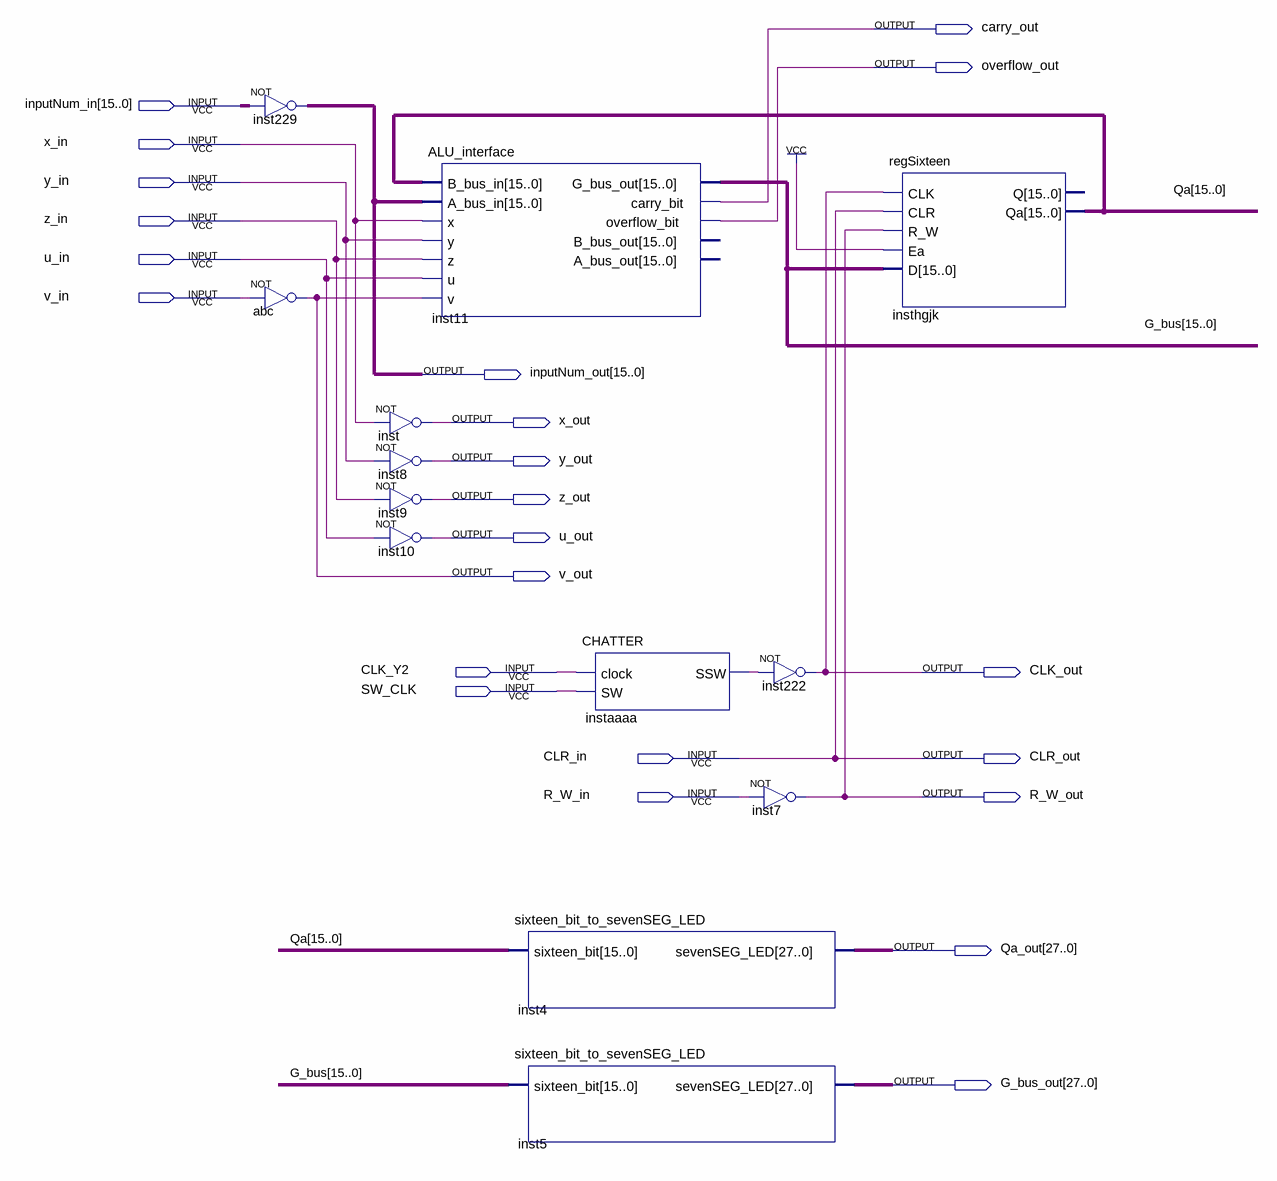
[diagram p0: schematic sheet]
// Quartus schematic ALU_expLogicCircuit.bdf as structural Verilog: 13 symbols, 23 pins
module ALU_expLogicCircuit (
  input  [15:0] inputNum_in,
  input  x_in,
  input  y_in,
  input  z_in,
  input  u_in,
  input  v_in,
  input  CLK_Y2,
  input  SW_CLK,
  input  CLR_in,
  input  R_W_in,
  output carry_out,
  output overflow_out,
  output [15:0] inputNum_out,
  output x_out,
  output y_out,
  output z_out,
  output u_out,
  output v_out,
  output CLK_out,
  output CLR_out,
  output R_W_out,
  output [27:0] Qa_out,
  output [27:0] G_bus_out
);

  wire instaaaa_ssw;
  wire [15:0] G_bus, Qa;

  assign inputNum_out = ~inputNum_in;  // NOT inst229, 16 bits wide
  not abc (v_out, v_in);
  ALU_interface inst11 (
    .B_bus_in(Qa), .A_bus_in(inputNum_out), .x(x_in), .y(y_in), .z(z_in), .u(u_in), .v(v_out),
    .G_bus_out(G_bus), .carry_bit(carry_out), .overflow_bit(overflow_out));  // open: B_bus_out, A_bus_out
  not inst (x_out, x_in);
  not inst8 (y_out, y_in);
  not inst9 (z_out, z_in);
  not inst10 (u_out, u_in);
  sixteen_bit_to_sevenSEG_LED inst4 (.sixteen_bit(Qa), .sevenSEG_LED(Qa_out));
  sixteen_bit_to_sevenSEG_LED inst5 (.sixteen_bit(G_bus), .sevenSEG_LED(G_bus_out));
  CHATTER instaaaa (.clock(CLK_Y2), .SW(SW_CLK), .SSW(instaaaa_ssw));
  not inst222 (CLK_out, instaaaa_ssw);
  not inst7 (R_W_out, R_W_in);
  regSixteen insthgjk (.CLK(CLK_out), .CLR(CLR_in), .R_W(R_W_out), .Ea(1'b1), .D(G_bus), .Qa(Qa));  // open: Q

  assign CLR_out = CLR_in;
endmodule
